# EAGLE design SwitchBoard (EAGLE 8.4.1)
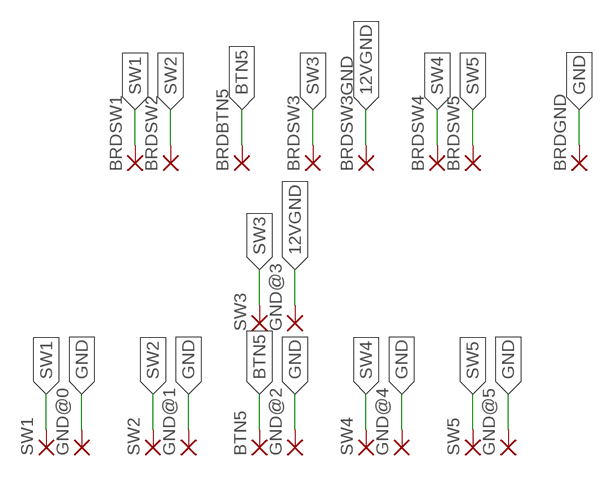
[diagram p0: schematic, sheet 1]

## Parts
BRDBTN5  SMD5  [SMD2,54-5,08]
BRDGND  SMD5  [SMD2,54-5,08]
BRDSW1  SMD5  [SMD2,54-5,08]
BRDSW2  SMD5  [SMD2,54-5,08]
BRDSW3  SMD5  [SMD2,54-5,08]
BRDSW3GND  SMD5  [SMD2,54-5,08]
BRDSW4  SMD5  [SMD2,54-5,08]
BRDSW5  SMD5  [SMD2,54-5,08]
BTN5  SMD5  [SMD2,54-5,08]
GND@0  SMD5  [SMD2,54-5,08]
GND@1  SMD5  [SMD2,54-5,08]
GND@2  SMD5  [SMD2,54-5,08]
GND@3  SMD5  [SMD2,54-5,08]
GND@4  SMD5  [SMD2,54-5,08]
GND@5  SMD5  [SMD2,54-5,08]
SW1  SMD5  [SMD2,54-5,08]
SW2  SMD5  [SMD2,54-5,08]
SW3  SMD5  [SMD2,54-5,08]
SW4  SMD5  [SMD2,54-5,08]
SW5  SMD5  [SMD2,54-5,08]

## Nets
12VGND: BRDSW3GND.1(P) GND@3.1(P)
BTN5: BRDBTN5.1(P) BTN5.1(P)
GND: BRDGND.1(P) GND@0.1(P) GND@1.1(P) GND@2.1(P) GND@4.1(P) GND@5.1(P)
SW1: BRDSW1.1(P) SW1.1(P)
SW2: BRDSW2.1(P) SW2.1(P)
SW3: BRDSW3.1(P) SW3.1(P)
SW4: BRDSW4.1(P) SW4.1(P)
SW5: BRDSW5.1(P) SW5.1(P)

## Library data of the parts
BRDBTN5 BRDGND BRDSW1-BRDSW3 BRDSW3GND BRDSW4 BRDSW5 BTN5 GND@0 GND@1-GND@5 SW1-SW5 = wirepad:SMD5: SMD PAD

## Board
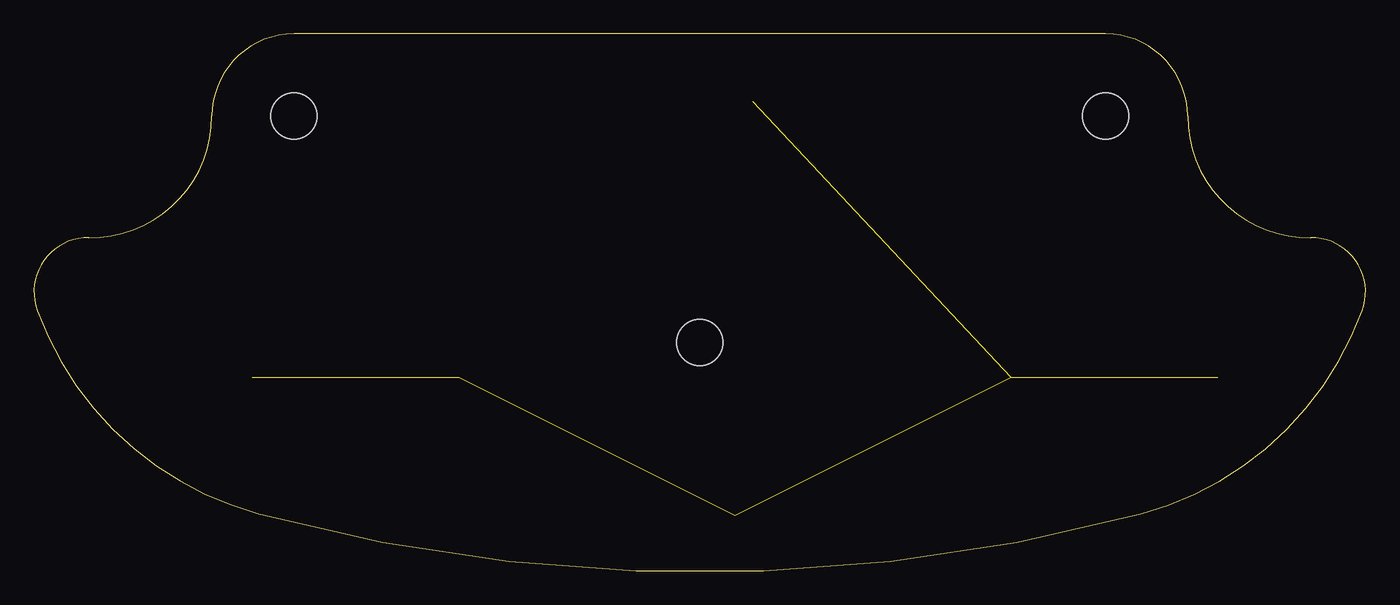
[diagram p1: board, top side]
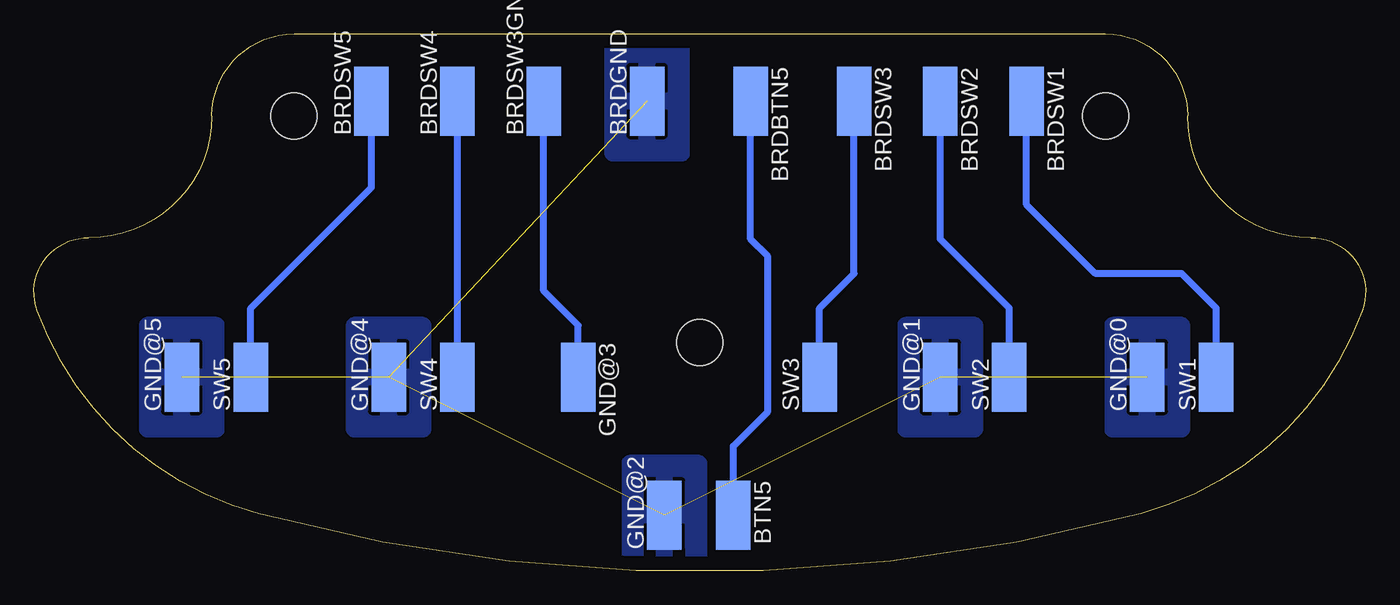
[diagram p2: board, bottom side, seen from below]

Size 98.09 x 39.53 mm. Coordinates in mm from the lower left corner, seen from the top.
Outline: 84.98,33.49 arc90 78.94,39.53 19.15,39.53 arc90 13.11,33.49 arc-91 4.04,24.53 arc111 0.24,19.16 arc55 16.54,4.21 arc30 81.54,4.21 arc55 97.85,19.16 arc111 94.04,24.53 arc-91 84.98,33.49
Copper layers (1*16): Top 0.035mm / dielectric 1.5mm / Bottom 0.035mm
Design rules "default": minimum track width 16mil, minimum drill 1mm, track to track 0.25mm, track to pad 0.25mm, pad to pad 0.25mm, via to via 0.25mm, smd to smd 0mil, copper to edge 40mil, drill to drill 6mil, minimum pad ring 10mil, minimum via ring 8mil, stop-mask expansion 4mil, vias tented up to drill 0mil, thermal gap 10mil
Holes 3.4 mm at 19.16,33.49 49.05,16.8 78.95,33.49

### Footprints (pad centres in the part's own frame; a part is rotated, then mirrored left to right if it is on the bottom)
SMD2,54-5,08 = smd 2.54 x 5.08: 1 0,0

### Placement (x,y rotation side)
BRDBTN5  45.29,34.58 180 bottom
BRDGND  52.91,34.58 0 bottom
BRDSW1  24.97,34.58 180 bottom
BRDSW2  31.32,34.58 180 bottom
BRDSW3  37.67,34.58 180 bottom
BRDSW3GND  60.53,34.58 0 bottom
BRDSW4  66.88,34.58 0 bottom
BRDSW5  73.23,34.58 0 bottom
BTN5  46.56,4.1 180 bottom
GND@0  16.08,14.26 0 bottom
GND@1  31.32,14.26 0 bottom
GND@2  51.64,4.1 0 bottom
GND@3  57.99,14.26 180 bottom
GND@4  71.96,14.26 0 bottom
GND@5  87.2,14.26 0 bottom
SW1  11,14.26 0 bottom
SW2  26.24,14.26 0 bottom
SW3  40.21,14.26 0 bottom
SW4  66.88,14.26 0 bottom
SW5  82.12,14.26 0 bottom

### Tracks (layer width: path | path; a pad name or v marks a point on that pad's centre or on a via)
12VGND
  Bottom 0.508: GND@3.1 57.99,18.07 59.26,19.34 60.53,20.61 BRDSW3GND.1
BTN5
  Bottom 0.508: BTN5.1 46.56,9.18 44.02,11.72 44.02,23.15 45.29,24.42 BRDBTN5.1
GND  (5 unrouted)
  pour Bottom: 49.1,7.91 54.18,7.91 54.18,1.05 49.1,1.05
  pour Bottom: 33.86,10.45 28.78,10.45 28.78,18.07 33.86,18.07
  pour Bottom: 13.54,18.07 18.62,18.07 18.62,10.45 13.54,10.45
  pour Bottom: 52.91,38.39 55.45,38.39 55.45,30.77 50.37,30.77 50.37,38.39
  pour Bottom: 74.5,10.45 69.42,10.45 69.42,18.07 74.5,18.07
  pour Bottom: 87.2,10.45 84.66,10.45 84.66,18.07 89.74,18.07 89.74,10.45
SW1
  Bottom 0.508: SW1.1 11,19.34 13.54,21.88 19.89,21.88 24.97,26.96 BRDSW1.1
SW2
  Bottom 0.508: SW2.1 26.24,19.34 31.32,24.42 BRDSW2.1
SW3
  Bottom 0.508: SW3.1 40.21,19.34 37.67,21.88 BRDSW3.1
SW4
  Bottom 0.508: SW4.1 BRDSW4.1
SW5
  Bottom 0.508: SW5.1 82.12,19.34 73.23,28.23 BRDSW5.1